# EasyEDA Pro project Drone.eprj

# Schematic HandMovement Sensor
Create Date: 2024-07-15; Page Name: P1; Project Name: Drone; Schematic Name: HandMovement Sensor; Update Date: 2024-07-15; Company: jonasheilig.de; Drawn: Jonas Heilig; Page Size: A4; Part Number: 1; Version: V0.1
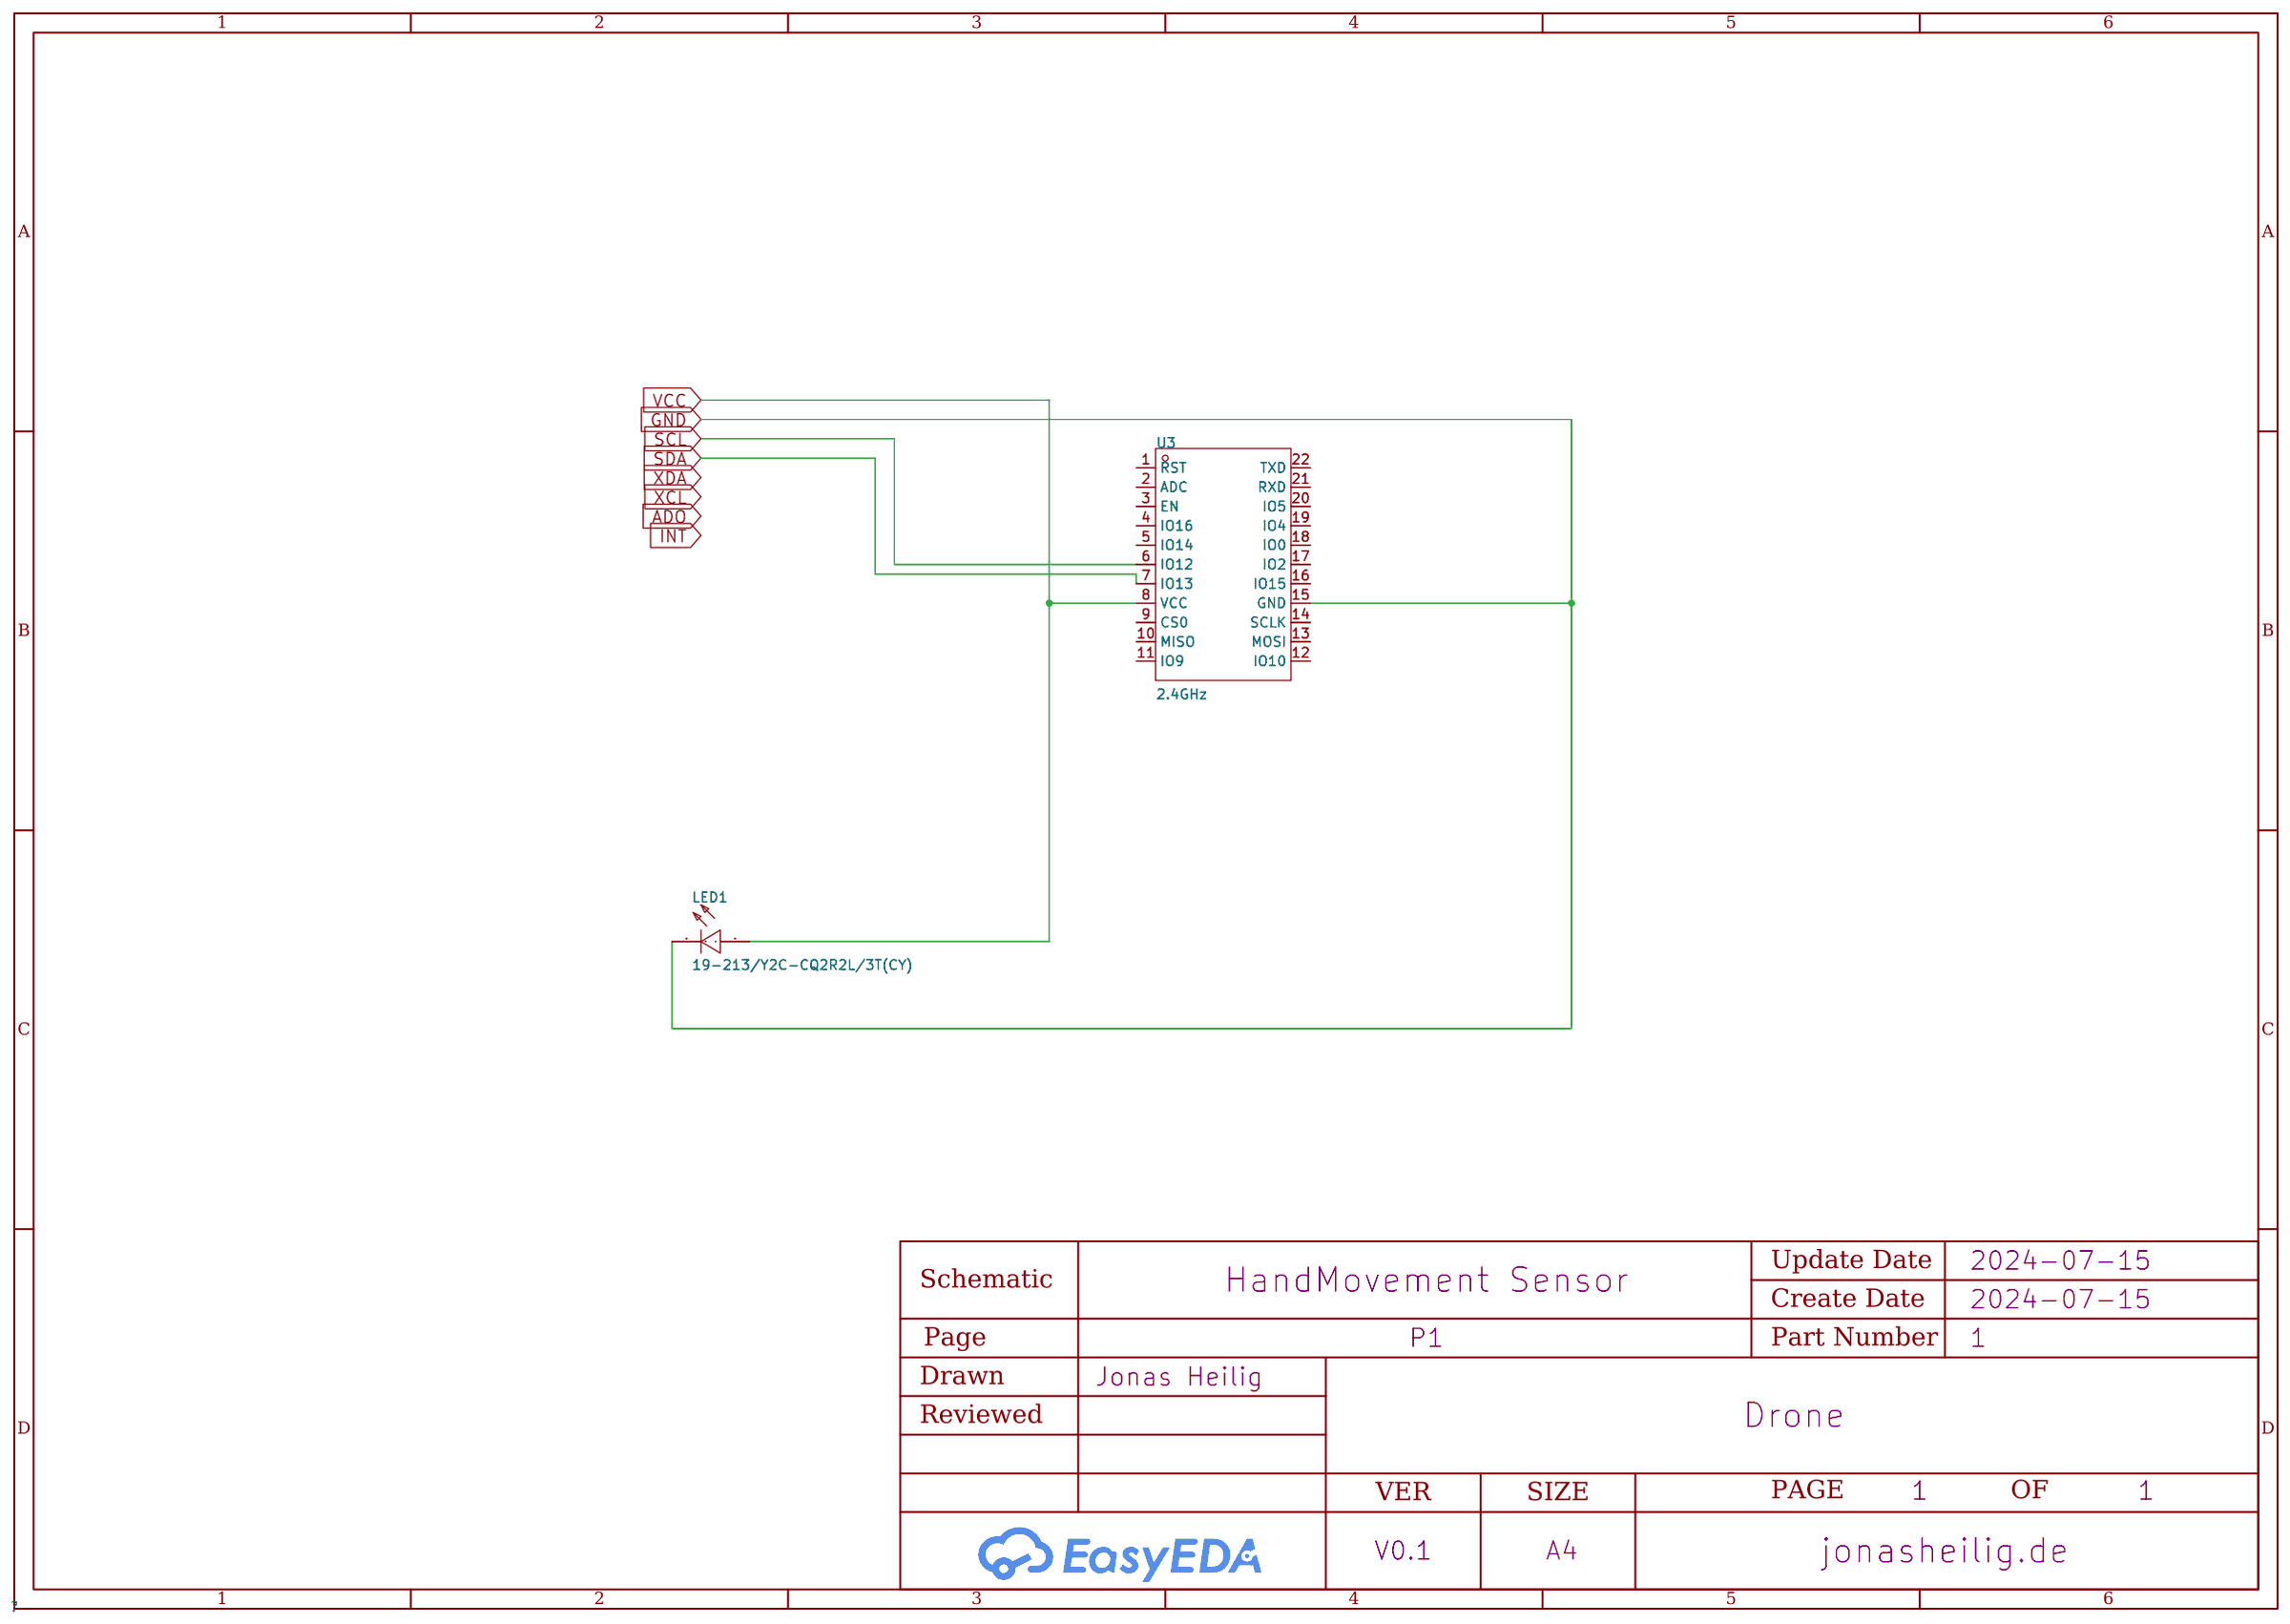
[diagram p0: schematic sheet]

## Parts
LED1  19-213/Y2C-CQ2R2L/3T(CY)  [LED0603-RD-YELLOW]
U3  2.4GHz  [WIRELM-SMD_ESP-12F]

## Library data of the parts
LED1 = 19-213/Y2C-CQ2R2L/3T(CY): Emitted Color:Yellow Power Dissipation:60mW Forward Current:20mA Dominant Wavelength:585.5nm~591.5nm Dominant Wavelength:585.5nm~591.5nm Peak Wavelength:591nm Diode Configuration:- Lens Color:无色透明透镜 Color Temperature:- Color Temperature:- Viewing Angle:12; LCSC Part Name: 黄灯; Supplier Part: C72038; Manufacturer: EVERLIGHT(亿光); Supplier Footprint: 0603; JLCPCB Part Class: Basic Part; Datasheet: https://atta.szlcsc.com/upload/public/pdf/source/20160507/1462613613586.pdf; Supplier: LCSC; Emitted Color: Yellow; Power Dissipation: 60mW; Forward Current: 20mA; Dominant Wavelength: 585.5nm~591.5nm; Peak Wavelength: 591nm; Lens Color: 无色透明透镜; Viewing Angle: 120°; Operating Temperature: -40℃~+85℃
U3 = ESP-12F: Wireless Standard:WIFI4 Support Interface:IO；UART Frequency:2.4GHz Antenna Type:PCB Output Power:15dBm Output Power:15dBm Operating Voltage:3.3V Operating Voltage:3.3V Receive  Current:55mA Send  Current:375mA Sensitivity:-96dBm Sensitivity:-96dBm Operati; LCSC Part Name: ESP8266 WiFi模组,32Mbit Flash, 通用模组; Supplier Part: C19949064; Manufacturer: DOIT(四博智联); Supplier Footprint: SMD,24x16mm; JLCPCB Part Class: Extended Part; Datasheet: https://atta.szlcsc.com/upload/public/pdf/source/20240112/4C731B83AC84B82D8ABE33233BB0FED4.pdf; Supplier: LCSC; Wireless Standard: WIFI4; Support Interface: IO；UART; Antenna Type: PCB; Output Power: 15dBm; Operating Voltage: 3.3V; Receive  Current: 55mA; Send  Current: 375mA; Sensitivity: -96dBm; Operating Temperature: -40℃~+85℃

## Nets
GND: LED1.1(C) U3.15(GND)
VCC: LED1.2(A) U3.8(VCC)
SCL: U3.6(IO12)
SDA: U3.7(IO13)

Not connected (* = marked no-connect by the designer): U3 1(RST) 2(ADC) 3(EN) 4(IO16) 5(IO14) 9(CS0) 10(MISO) 11(IO9) 12(IO10) 13(MOSI) 14(SCLK) 16(IO15) 17(IO2) 18(IO0) 19(IO4) 20(IO5) 21(RXD) 22(TXD)

# Schematic MotorController
Create Date: 2024-07-16; Page Name: P1; Project Name: Drone; Schematic Name: MotorController; Update Date: 2024-07-16; Company: jonasheilig.de; Drawn: Jonas Heilig; Page Size: A4; Part Number: 2; Version: V0.1
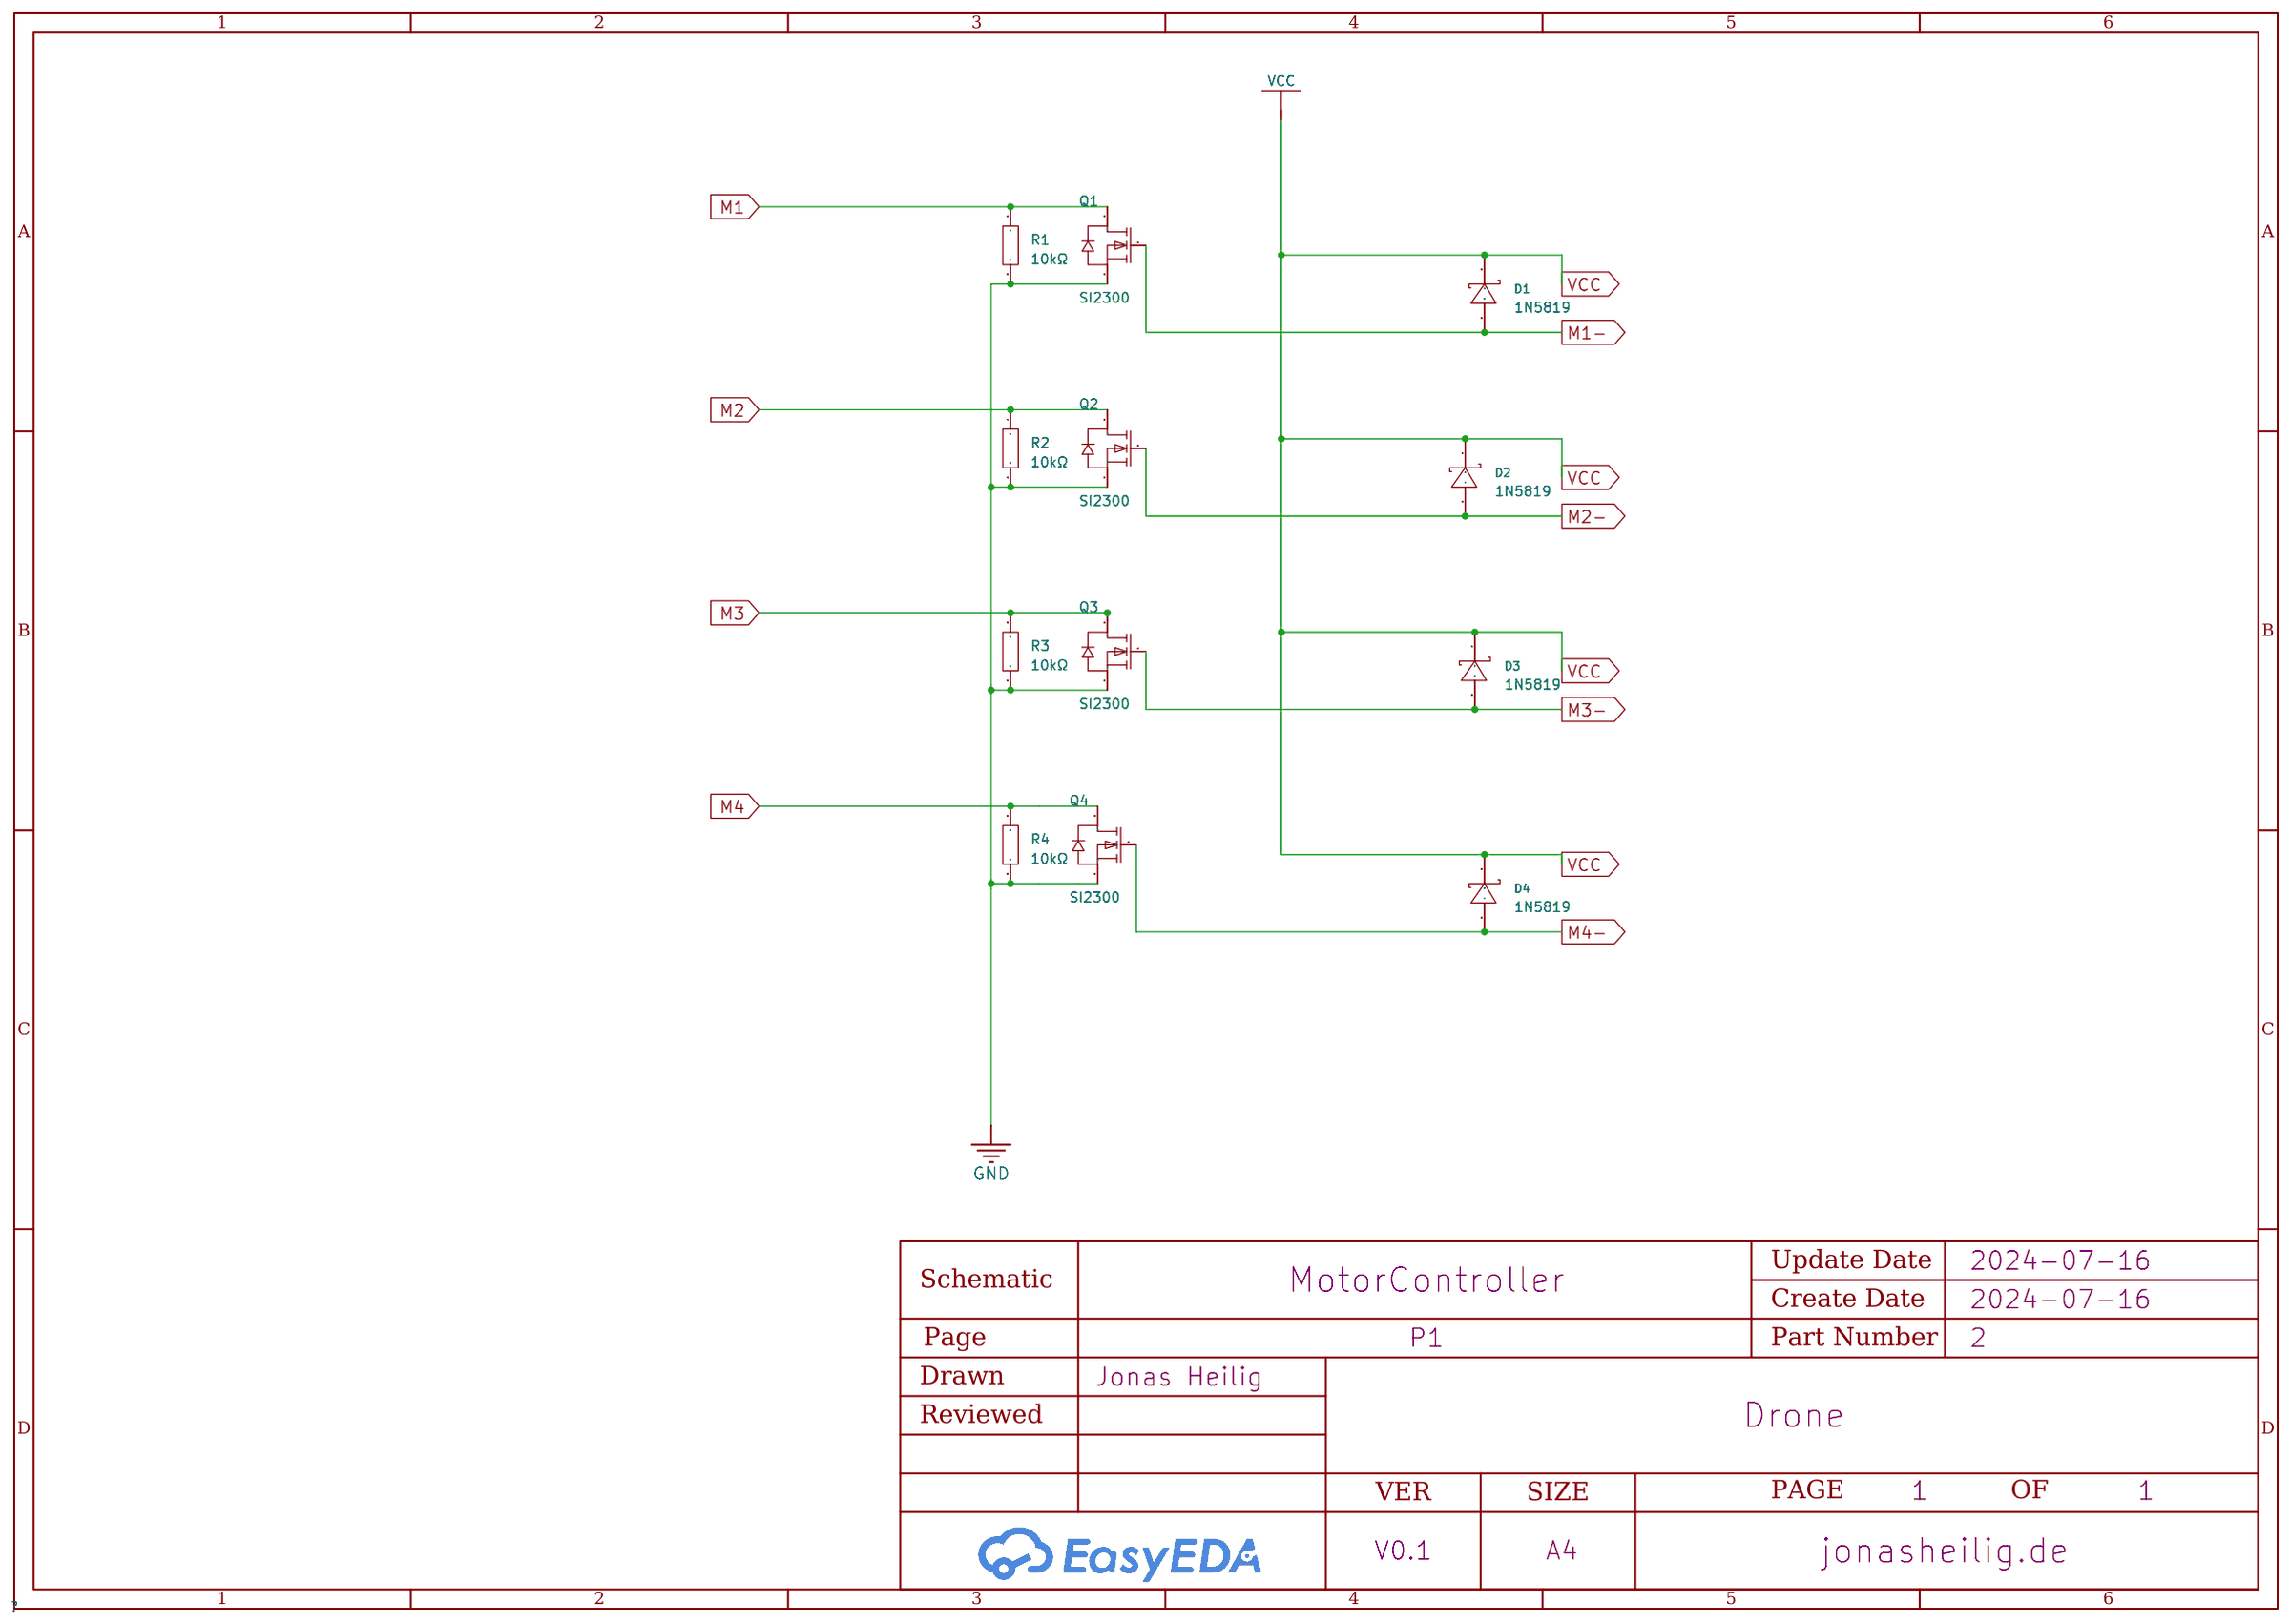
[diagram p1: schematic sheet]

## Parts
D1  1N5819  [SMA_L4.4-W2.6-LS5.0-RD]
D2  1N5819  [SMA_L4.4-W2.6-LS5.0-RD]
D3  1N5819  [SMA_L4.4-W2.6-LS5.0-RD]
D4  1N5819  [SMA_L4.4-W2.6-LS5.0-RD]
Q1  SI2300  [SOT-23-3_L2.9-W1.6-P1.90-LS2.8-BR]
Q2  SI2300  [SOT-23-3_L2.9-W1.6-P1.90-LS2.8-BR]
Q3  SI2300  [SOT-23-3_L2.9-W1.6-P1.90-LS2.8-BR]
Q4  SI2300  [SOT-23-3_L2.9-W1.6-P1.90-LS2.8-BR]
R1  10kΩ  [R0402]
R2  10kΩ  [R0402]
R3  10kΩ  [R0402]
R4  10kΩ  [R0402]

## Library data of the parts
D1-D4 = 1N5819_C437199: Forward Voltage (Vf@If):500mV@1A Reverse Voltage (Vr):40V Average Rectified Current (Io):1A; LCSC Part Name: 电压:40V 电流:1A; Supplier Part: C437199; Manufacturer: KEXIN(科信); Supplier Footprint: DO-214AC(SMA); JLCPCB Part Class: Extended Part; Datasheet: https://atta.szlcsc.com/upload/public/pdf/source/20191012/C437199_83583E622A6684E767605E43C169C596.pdf; Supplier: LCSC; Forward Voltage (Vf@If): 500mV@1A; Reverse Voltage (Vr): 40V; Average Rectified Current (Io): 1A
Q1-Q4 = SI2300_C2891729: Type:1个NChannel Drain Source Voltage (Vdss): Continuous Drain Current (Id): Power Dissipation (Pd):400mW Drain Source On Resistance (RDS(on)@Vgs,Id):45mΩ@4.5V,3.6A Gate Threshold Voltage (Vgs(th)@Id):1.2V@50uA Total Gate Charge (Qg@Vgs):- Input Capacitanc; LCSC Part Name: 1个N沟道 耐压:20V 电流:3A; Supplier Part: C2891729; Manufacturer: YONGYUTAI(永裕泰); Supplier Footprint: SOT-23-3L; JLCPCB Part Class: Extended Part; Datasheet: https://atta.szlcsc.com/upload/public/pdf/source/20210901/C2891729_E51005BC5CF1E4F125F2CC2E100B23EF.pdf; Supplier: LCSC; Type: 1个NChannel; Power Dissipation (Pd): 400mW; Drain Source On Resistance (RDS(on)@Vgs,Id): 45mΩ@4.5V,3.6A; Gate Threshold Voltage (Vgs(th)@Id): 1.2V@50uA; Input Capacitance (Ciss@Vds): 300pF@10V; Reverse Transfer Capacitance (Crss@Vds): 80pF@10V
R1-R4 = 0402WGF1002TCE: Type:Thick Film Resistors Resistance:10kΩ Tolerance:±1% Tolerance:±1% Power(Watts): Overload Voltage (Max): Temperature Coefficient:±100ppm/℃ Temperature Coefficient:±100ppm/℃ Operating Temperature Range:-55℃~+155℃ Operating Temperature Range:-55℃~+155℃; LCSC Part Name: 10kΩ ±1% 62.5mW 厚膜电阻; Supplier Part: C25744; Manufacturer: UNI-ROYAL(厚声); Supplier Footprint: 0402; JLCPCB Part Class: Basic Part; Datasheet: https://atta.szlcsc.com/upload/public/pdf/source/20200306/C422600_1E6D84923E4A46A82E41ADD87F860B5C.pdf; Supplier: LCSC; Type: Thick Film Resistors; Tolerance: ±1%; Temperature Coefficient: ±100ppm/℃; Operating Temperature Range: -55℃~+155℃

## Nets
GND: Q1.2(S) Q2.2(S) Q3.2(S) Q4.2(S) R1.2 R2.2 R3.2 R4.2
VCC: D1.1(C) D2.1(C) D3.1(C) D4.1(C)
M1: Q1.3(D) R1.1
M1-: D1.2(A) Q1.1(G)
M2: Q2.3(D) R2.1
M2-: D2.2(A) Q2.1(G)
M3: Q3.3(D) R3.1
M3-: D3.2(A) Q3.1(G)
M4: Q4.3(D) R4.1
M4-: D4.2(A) Q4.1(G)

# Board PCB6
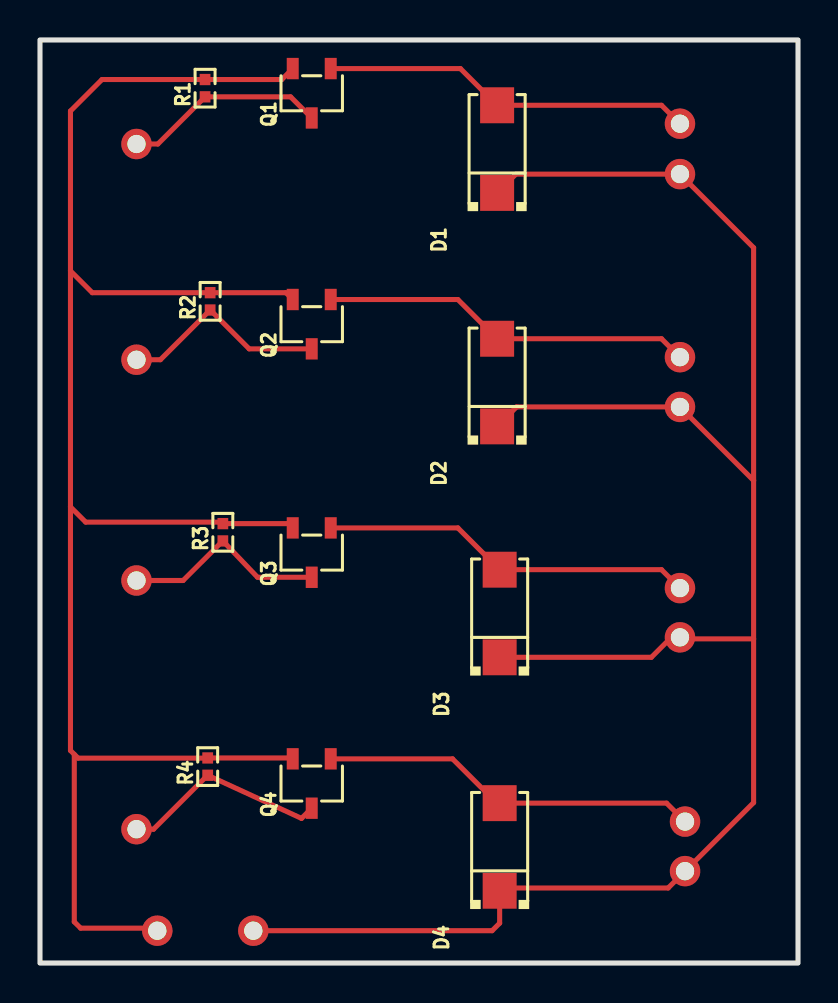
[diagram p2: board, top side]
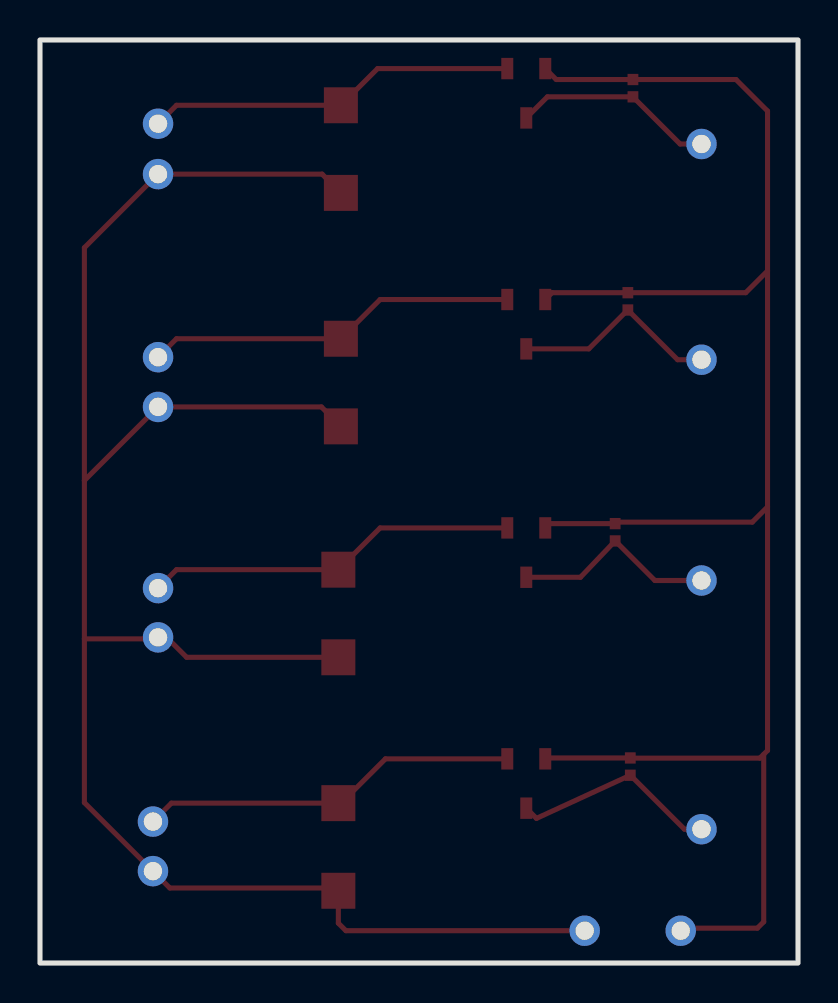
[diagram p3: board, bottom side, seen from below]

Outline 37.91 x 46.2 mm; copper layers: Top Layer, Bottom Layer. Coordinates in mm from the lower left corner of the outline.
Outline path: rectangle 0,46.2 37.91,0
Stack: Top Layer 0.035mm / Dielectric1 1.51mm FR4 er 4.5 / Bottom Layer 0.035mm

## Design rules (mm)
template: JLCPCB Capability(Two Layers Board)
spacing copperThickness1oz (default): track to track 0.102, other pairs 0.152 to 0.3
spacing copperThickness2oz: track to track 0.203, other pairs 0.152 to 0.3
track width copperThickness1oz (default): min 0.127, default 0.254, max 2.54
track width copperThickness2oz: min 0.203, default 0.254, max 2.54
differential pair differentialPair (default): width min 0.127, default 0.254, max 2.54; gap min 0.152, default 0.152
via viaSize (default): diameter min 0.5, default 0.61, max 10; hole min 0.3, default 0.305, max 6.3

## Placement (name value [footprint] x y rotation side)
D1  1N5819  [SMA_L4.4-W2.6-LS5.0-RD]  22.86 40.73 90 top
D2  1N5819  [SMA_L4.4-W2.6-LS5.0-RD]  22.86 29.05 90 top
D3  1N5819  [SMA_L4.4-W2.6-LS5.0-RD]  22.99 17.49 90 top
D4  1N5819  [SMA_L4.4-W2.6-LS5.0-RD]  22.99 5.81 90 top
NOREF  -  [Pad_e47]  4.83 40.99 0 top
NOREF#2  -  [Pad_e49]  4.83 19.14 0 top
NOREF#3  -  [Pad_e56]  10.67 1.62 0 top
NOREF#4  -  [Pad_e88]  32.26 4.6 0 top
NOREF#5  -  [Pad_e86]  32 16.3 0 top
NOREF#6  -  [Pad_e80]  32 39.48 0 top
NOREF#7  -  [Pad_e83]  32 30.32 0 top
NOREF#8  -  [Pad_e85]  32 18.76 0 top
NOREF#9  -  [Pad_e84]  32 27.83 0 top
NOREF#10  -  [Pad_e87]  32.26 7.08 0 top
NOREF#11  -  [Pad_e50]  4.83 6.7 0 top
NOREF#12  -  [Pad_e48]  4.83 30.19 0 top
NOREF#13  -  [Pad_e57]  5.87 1.62 0 top
NOREF#14  -  [Pad_e79]  32 42 0 top
Q1  SI2300  [SOT-23-3_L2.9-W1.6-P1.90-LS2.8-BR]  13.59 43.53 90 top
Q2  SI2300  [SOT-23-3_L2.9-W1.6-P1.90-LS2.8-BR]  13.59 31.97 90 top
Q3  SI2300  [SOT-23-3_L2.9-W1.6-P1.90-LS2.8-BR]  13.59 20.54 90 top
Q4  SI2300  [SOT-23-3_L2.9-W1.6-P1.90-LS2.8-BR]  13.59 8.98 90 top
R1  10kΩ  [R0402]  8.25 43.78 90 top
R2  10kΩ  [R0402]  8.51 33.11 90 top
R3  10kΩ  [R0402]  9.14 21.56 90 top
R4  10kΩ  [R0402]  8.39 9.83 90 top

## Footprints (pads in the part's own frame, mm; a bottom-side part is the same pattern mirrored in y, then rotated)
Pad_e47
  round 1.524 hole 0.914: 5(0,0)
Pad_e48
  round 1.524 hole 0.914: 6(0,0)
Pad_e49
  round 1.524 hole 0.914: 7(0,0)
Pad_e50
  round 1.524 hole 0.914: 8(0,0)
Pad_e56
  round 1.524 hole 0.914: 4(0,0)
Pad_e57
  round 1.524 hole 0.914: 9(0,0)
Pad_e79
  round 1.524 hole 0.914: 10(0,0)
Pad_e80
  round 1.524 hole 0.914: 11(0,0)
Pad_e83
  round 1.524 hole 0.914: 12(0,0)
Pad_e84
  round 1.524 hole 0.914: 13(0,0)
Pad_e85
  round 1.524 hole 0.914: 14(0,0)
Pad_e86
  round 1.524 hole 0.914: 15(0,0)
Pad_e87
  round 1.524 hole 0.914: 16(0,0)
Pad_e88
  round 1.524 hole 0.914: 17(0,0)
R0402
  rect 0.566x0.54 smd: 1(-0.433,0) 2(0.433,0)
SMA_L4.4-W2.6-LS5.0-RD
  rect 1.8x1.7 smd: 1(-2.192,0) 2(2.192,0)
SOT-23-3_L2.9-W1.6-P1.90-LS2.8-BR
  rect 1.07x0.6 smd: 1(1.235,-0.95) 2(1.235,0.95) 3(-1.235,0)

## Nets
As in the schematic.

Pads without a net: NOREF 5; NOREF#2 7; NOREF#3 4; NOREF#4 17; NOREF#5 15; NOREF#6 11; NOREF#7 12; NOREF#8 14; NOREF#9 13; NOREF#10 16; NOREF#11 8; NOREF#12 6; NOREF#13 9; NOREF#14 10

## Routing (per net, layer and track width the routed paths; a pad name or vN(x,y) marks a point on that pad's centre or on a via; arc(x,y) is an arc through that point)
GND: length 91.3
  Top Layer w0.254: 1.52,34.64 1.52,42.64 3.1,44.22 R1.2 12.09,44.22 Q1.2 ; 1.52,34.64 1.52,22.83 ; 1.52,34.64 2.62,33.55 R2.2 12.3,33.55 Q2.2 ; 1.52,22.83 1.52,10.64 1.91,10.25 8.39,10.25 ; 1.52,22.83 2.29,22.07 9.07,22.07 R3.2 12.43,21.99 Q3.2 ; 1.71,10.44 1.71,2.06 2.03,1.75 5.74,1.75 5.87,1.62 ; R4.2 12.59,10.26 Q4.2
VCC: length 99.3
  Top Layer w0.254: 10.67,1.62 22.61,1.62 22.99,2 22.99,3.76 31.41,3.76 35.69,8.03 35.69,16.22 ; D1.1 23.8,39.48 32,39.48 35.69,35.8 35.69,24.15 ; D2.1 23.83,27.83 32,27.83 35.69,24.15 ; D3.1 30.57,15.3 31.75,16.48 32,16.22 35.69,16.22 ; 35.69,24.15 35.69,16.22
M1: length 10.2
  Top Layer w0.254: 4.83,40.99 5.89,40.99 R1.1 12.53,43.35 Q1.3
M1-: length 18.6
  Top Layer w0.254: Q1.1 21.02,44.76 D1.2 31.08,42.93 32,42
M2: length 10.6
  Top Layer w0.254: 4.83,30.19 6.02,30.19 R2.1 ; 8.51,32.69 10.46,30.74 Q2.3
M2-: length 18.7
  Top Layer w0.254: Q2.1 20.9,33.21 D2.2 31.08,31.24 32,30.32
M3: length 10.4
  Top Layer w0.254: 4.83,19.14 7.16,19.14 9.14,21.13 ; R3.1 10.88,19.31 Q3.3
M3-: length 18.7
  Top Layer w0.254: Q3.1 20.9,21.78 D3.2 31.08,19.69 32,18.76
M4: length 10.6
  Top Layer w0.254: 4.83,6.7 5.68,6.7 8.39,9.41 ; R4.1 13.08,7.24 Q4.3
M4-: length 19.1
  Top Layer w0.254: Q4.1 20.63,10.22 22.99,7.86 ; D4.2 31.34,8 32.26,7.08
